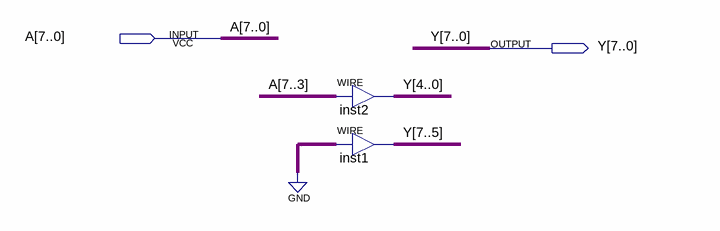
[diagram p0: schematic sheet]
// Quartus schematic 3BitRigthShift.bdf as structural Verilog: 2 symbols, 2 pins
module \3BitRigthShift  (
  input  [7:0] A,
  output [7:0] Y
);

  assign Y[4:0] = A[7:3];  // WIRE inst2
  assign Y[7:5] = 3'b000;  // WIRE inst1
endmodule
